# EAGLE design New_rev2 (EAGLE 6.1)
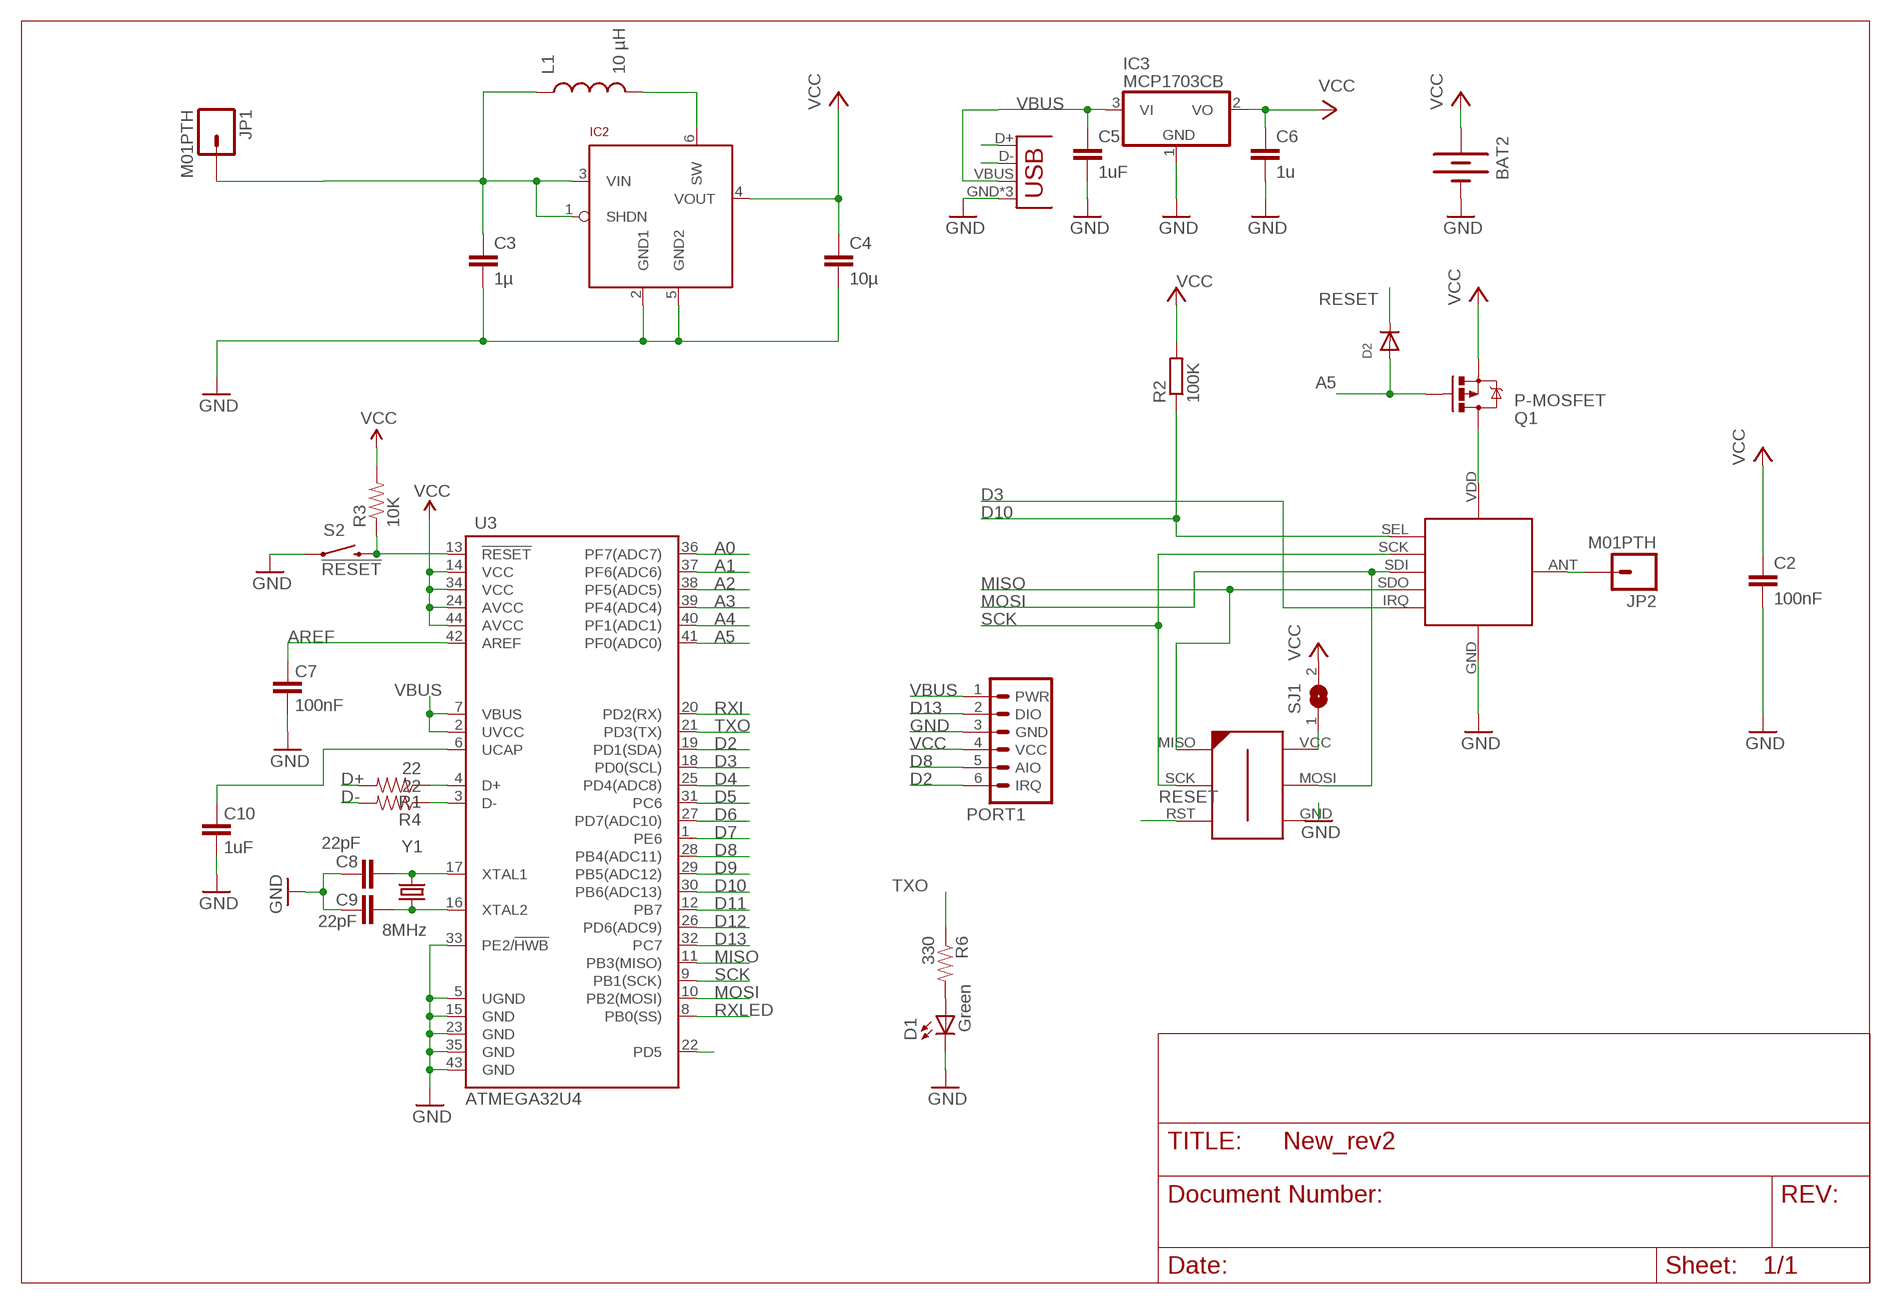
[diagram p0: schematic, sheet 1]

## Parts
BAT2  BATTERY20PTH  [BATTCOM_20MM_PTH]
C2  100nF  C-EUC0603K  [C0603K]
C3  1µ  CAP0603-CAP  [0603-CAP]
C4  10µ  CAP0805  [0805]
C5  1uF  C-EUC0603K  [C0603K]
C6  1u  C-EUC0603K  [C0603K]
C7  100nF  CAP0402-CAP  [0402-CAP]
C8  22pF  CAP0402-CAP  [0402-CAP]
C9  22pF  CAP0402-CAP  [0402-CAP]
C10  1uF  CAP0402-CAP  [0402-CAP]
D1  Green  LED0603  [LED-0603]
D2  DIODESOD-323F  [SOD-323F]
IC2  LTC3525  [SC70]
IC3  MCP1703CB  [SOT23]
JP1  M01PTH  [1X01]
JP2  M01PTH  [1X01]
JP3  USB-MICROB  [USB-MICROB]
L1  10 µH  INDUCTOR1210  [1210]
PORT1  JEEPORT-FEMALE  [1X06_FEMALE_LOCK.010]
Q1  P-MOSFET  MOSFET-PCHANNEL  [SOT23]
R1  22  RESISTOR0402-RES  [0402-RES]
R2  100K  R-EU_R0402  [R0402]
R3  10K  RESISTOR0402-RES  [0402-RES]
R4  22  RESISTOR0402-RES  [0402-RES]
R6  330  RESISTOR0402-RES  [0402-RES]
RFM12B1  RFM12B_MINPADS  [RFM12B-MINPADS]
S2  !RESET  SWITCH-MOMENTARY-2SMD  [TACTILE_SWITCH_SMD]
SJ1  SJ  [SJ]
U3  ATMEGA32U4  ATMEGA32U4QFN2  [QFN-44-NOPAD]
U$2  AVR-ISP-6-EDGE  [6PAD_ISP]
Y1  8MHz  CRYSTAL5X3  [CRYSTAL-SMD-5X3]

## Nets
A0: U3.36(PF7(ADC7))
A1: U3.37(PF6(ADC6))
A2: U3.38(PF5(ADC5))
A3: U3.39(PF4(ADC4))
A4: U3.40(PF1(ADC1))
A5: D2.A Q1.1(G) U3.41(PF0(ADC0))
AREF: C7.2 U3.42(AREF)
D2: PORT1.6(IRQ) U3.19(PD1(SDA))
D3: RFM12B1.IRQ U3.18(PD0(SCL))
D4: U3.25(PD4(ADC8))
D5: U3.31(PC6)
D6: U3.27(PD7(ADC10))
D7: U3.1(PE6)
D8: PORT1.5(AIO) U3.28(PB4(ADC11))
D9: U3.29(PB5(ADC12))
D10: R2.1 RFM12B1.SEL U3.30(PB6(ADC13))
D11: U3.12(PB7)
D12: U3.26(PD6(ADC9))
D13: PORT1.2(DIO) U3.32(PC7)
D+: JP3.D+ R1.2
D-: JP3.D- R4.2
GND: BAT2.2(-) C2.2 C3.2 C4.2 C5.2 C6.2 C7.1 C8.2 C9.2 C10.1 D1.C IC2.2(GND1) IC2.5(GND2) IC3.1(GND) JP3.GND JP3.MT1(GND) JP3.MT2(GND) PORT1.3(GND) RFM12B1.GND S2.1 U3.5(UGND) U3.15(GND) U3.23(GND) U3.33(PE2/!HWB) U3.35(GND) U3.43(GND) U$2.GND
MISO: RFM12B1.SDO(SDO/MISO) U3.11(PB3(MISO)) U$2.MISO
MOSI: RFM12B1.SDI(SDI/MOSI) U3.10(PB2(MOSI)) U$2.MOSI
N$1: C9.1 U3.16(XTAL2) Y1.1
N$2: R1.1 U3.4(D+)
N$3: JP2.1 RFM12B1.ANT
N$4: C8.1 U3.17(XTAL1) Y1.3
N$5: C10.2 U3.6(UCAP)
N$6: D1.A R6.2
N$7: R4.1 U3.3(D-)
N$8: U3.22(PD5)
N$9: SJ1.1 U$2.VCC
N$10: Q1.3(D) RFM12B1.VDD
N$13 [vcc]: IC2.6(SW) L1.2
RESET: D2.C R3.1 S2.3 U3.13(!RESET) U$2.RST
RXI: U3.20(PD2(RX))
RXLED: U3.8(PB0(SS))
SCK: RFM12B1.SCK U3.9(PB1(SCK)) U$2.SCK
TXO: R6.1 U3.21(PD3(TX))
VBUS: C5.1 IC3.3(VI) JP3.VBUS PORT1.1(PWR) U3.2(UVCC) U3.7(VBUS)
VCC: BAT2.1(+) C2.1 C4.1 C6.1 IC2.4(VOUT) IC3.2(VO) PORT1.4(VCC) Q1.2(S) R2.2 R3.2 SJ1.2 U3.14(VCC) U3.24(AVCC) U3.34(VCC) U3.44(AVCC)
VIN: C3.1 IC2.1(SHDN) IC2.3(VIN) JP1.1 L1.1

## Library data of the parts
BAT2 = SparkFun:BATTERY: Battery Holders Various common sizes : AA, AAA, 20mm coin cell and 12mm coin cell.
C2 C5 C6 = rcl:C-EU: CAPACITOR, European symbol
C3 C4 C7-C10 = SparkFun:CAP: Capacitor Standard 0603 ceramic capacitor, and 0.1" leaded capacitor.
D1 = SparkFun:LED: LEDs Standard schematic elements and footprints for 5mm, 3mm, 1206, and 0603 sized LEDs. 5mm - Spark Fun Electronics SKU : COM-00529 (and others)
D2 = adafruit:DIODE: Diode SMADIODE - SMA Surface Mount Package 20V 1A Schottky Diode Digikey: 641-1014-6-ND DO-1N4148 - Through Hole Small Current Diode SOD-123 20V 1 A (.5mV Vf) Schottky Diode - Digikey: MBRX120TPMSCT-ND SOD-323 10V 570mA (.38mV Vf, 3ns) Schottky Diode - Digikey: ZLLS410CT-ND SOD-523 30V 30mA Schottky Diode (RB751S-40TE61) - Digikey: RB751S-40TE61CT-ND SOT23-R/W - SOT23 Package (R = Solder Paste/Reflow Ovens, W = Hand-Soldering) BAT54Film 40V 300mA - Digikey: 497-7162-1-ND
IC2 = JeeLabs:LTC3525
IC3 = linear:MCP1703: 250 mA, 16V, Low Quiescent Current LDO Regulator Source: http://ww1.microchip.com/downloads/en/DeviceDoc/22049b.pdf
JP1 JP2 = SparkFun:M01: Header 1 Standard 1-pin 0.1" header. Use with straight break away headers (SKU : PRT-00116), right angle break away headers (PRT-00553), swiss pins (PRT-00743), machine pins (PRT-00117), and female headers (PRT-00115).
JP3 = SparkFun-Connectors:USB: USB Connectors USB-B-PTH is fully proven SKU : PRT-00139/CONN-08278 USB-miniB is fully proven SKU : PRT-00587 USB-A-PCB is untested. USB-A-H is throughly reviewed, but untested. Spark Fun Electronics SKU : PRT-00437 USB-B-SMT is throughly reviewed, but untested. Needs silkscreen touching up. USB-A-S has not been used/tested USB-MB-H has not been used/tested USB-MICROB has been used. CONN-09505; PROD_ID: CONN-09505
L1 = SparkFun:INDUCTOR: Inductors Basic Inductor/Choke - 0603 and 1206. Footprints are not proven and vary greatly between part numbers.
PORT1 = JeeParts:JEEPORT: PIN HEADER
Q1 = SparkFun:MOSFET-PCHANNEL
R1 R3 R4 R6 = SparkFun:RESISTOR: Resistor Basic schematic elements and footprints for 0603, 1206, and PTH resistors.
R2 = resistor:R-EU_: RESISTOR, European symbol
RFM12B1 = LowPowerLab:RFM12B_MINPADS
S2 = SparkFun-Electromechanical:SWITCH-MOMENTARY-2: Various NO switches- pushbuttons, reed, etc; PROD_ID: SWCH-08247
SJ1 = jumper:SJ: SMD solder JUMPER
U3 = SparkFun:ATMEGA32U4
U$2 = avr-7:AVR-ISP-6-EDGE: 6 pin edge connector for ISP with ATMEL MCUs. Developed by Craig Moates (craig at moates dot net). Library by David Blundell (blundar at gmail dot com). Often, even a 6 pin header is really inconvenient for board layout and/or production. This SMD-only header is our de-facto standard for using an edge connector for programming with the help of a 6pin/10pin to edge card adapter.
Y1 = SparkFun:CRYSTAL: Crystals Various standard crystals. Proven footprints. Spark Fun Electronics SKU : COM-00534

## Board
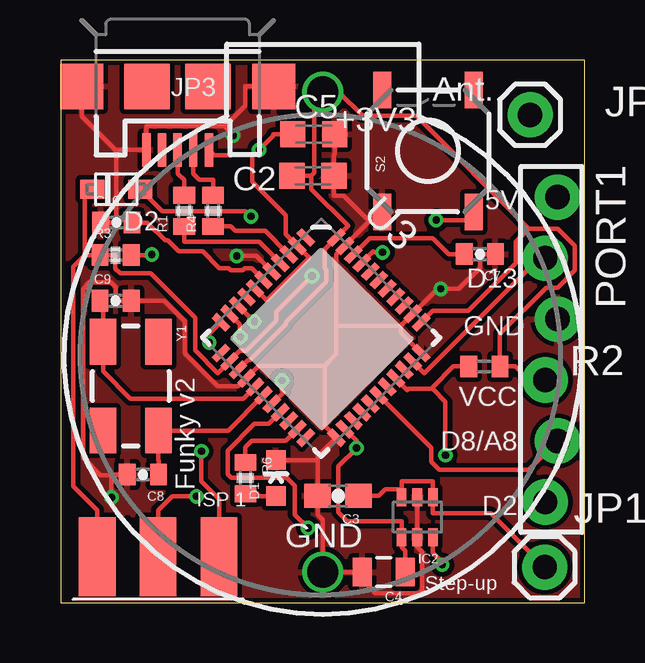
[diagram p1: board, top side]
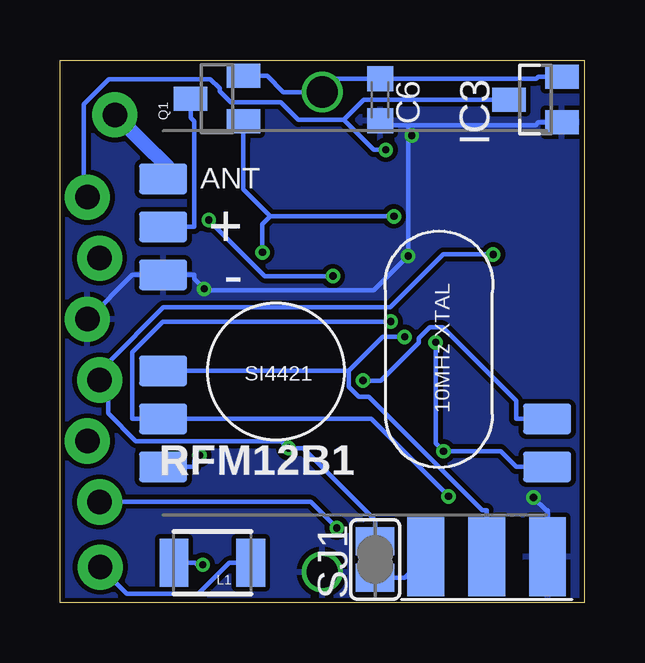
[diagram p2: board, bottom side, seen from below]

Size 21.84 x 22.61 mm. Coordinates in mm from the lower left corner, seen from the top.
Outline: 0,0 21.84,0 21.84,22.61 0,22.61 0,0
Copper layers (1*16): Top 0.035mm / dielectric 1.5mm / Bottom 0.035mm
Design rules: minimum track width 0.2mm, minimum drill 0.3mm, track to track 0.2mm, track to pad 0.2mm, pad to pad 0.2mm, via to via 0.2mm, smd to smd 0.2mm, copper to edge 0.2mm, drill to drill 0.2mm, minimum pad ring 0.2mm, minimum via ring 0.15mm, stop-mask expansion 0.075mm, vias tented up to drill 0.3mm, thermal gap 0.2mm
tRestrict: 2 lines
bRestrict: 2 lines

### Footprints (pad centres in the part's own frame; a part is rotated, then mirrored left to right if it is on the bottom)
BATTCOM_20MM_PTH = drill 1.3: 1 20,0; 2 0,0
C0603K = smd 1.05 x 1.08: 1 -0.875,0; 2 0.875,0
0603-CAP = smd 1.1 x 1: 1 -0.85,0; 2 0.85,0
0805 = smd 0.8 x 1.2: 1 -0.9,0; 2 0.9,0
0402-CAP = smd 0.7 x 0.9: 1 -0.65,0; 2 0.65,0
LED-0603 = smd 0.8 x 0.8: A 0,-0.75; C 0,0.75
SOD-323F = smd 1 x 0.8: A -1,0; C 1,0
SC70 = smd 0.4 x 0.75: 1 -0.65,-0.825; 2 0,-0.825; 3 0.65,-0.825; 4 0.65,0.825; 5 0,0.825; 6 -0.65,0.825
SOT23 = smd 1 x 1.4: 1 -0.95,-1.1; 2 0.95,-1.1; 3 0,1.1
1X01 = drill 1.016 pad 1.88: 1 0,0
USB-MICROB = smd 0.35 x 1.4: D+ 0,2.65; D- -0.65,2.65; GND 1.3,2.65; ID 0.65,2.65; VBUS -1.3,2.65 | smd 1.8 x 1.9: MT1 -4,0; MT2 4,0 | smd 1.9 x 1.9: P$1 -1.27,0; P$2 1.27,0
1210 = smd 1.2 x 2: 1 -1.6,0; 2 1.6,0
1X06_FEMALE_LOCK.010 = drill 1.016 pad 1.88: 1 0,0.254; 2 2.54,-0.254; 3 5.08,0.254; 4 7.62,-0.254; 5 10.16,0.254; 6 12.7,-0.254
0402-RES = smd 0.7 x 0.9: 1 -0.65,0; 2 0.65,0
R0402 = smd 0.7 x 0.9: 1 -0.65,0; 2 0.65,0
RFM12B-MINPADS = smd 2 x 1.27: ANT 8,-6; GND 8,-2; IRQ -8,4; SCK 8,4; SDI 8,2; SDO -8,6; SEL 8,6; VDD 8,-4
TACTILE_SWITCH_SMD = smd 1.524 x 0.762: 1 -2.54,1.905; 2 2.54,1.905; 3 -2.54,-1.905; 4 2.54,-1.905
SJ = smd 1.168 x 1.6: 1 -0.762,0; 2 0.762,0
QFN-44-NOPAD = smd 0.8 x 0.3: 1 -3.4,2.5; 2 -3.4,2; 3 -3.4,1.5; 4 -3.4,1; 5 -3.4,0.5; 6 -3.4,0; 7 -3.4,-0.5; 8 -3.4,-1; 9 -3.4,-1.5; 10 -3.4,-2; 11 -3.4,-2.5; 23 3.4,-2.5; 24 3.4,-2; 25 3.4,-1.5; 26 3.4,-1; 27 3.4,-0.5; 28 3.4,0; 29 3.4,0.5; 30 3.4,1; 31 3.4,1.5; 32 3.4,2; 33 3.4,2.5 | smd 0.3 x 0.8: 12 -2.5,-3.4; 13 -2,-3.4; 14 -1.5,-3.4; 15 -1,-3.4; 16 -0.5,-3.4; 17 0,-3.4; 18 0.5,-3.4; 19 1,-3.4; 20 1.5,-3.4; 21 2,-3.4; 22 2.5,-3.4; 34 2.5,3.4; 35 2,3.4; 36 1.5,3.4; 37 1,3.4; 38 0.5,3.4; 39 0,3.4; 40 -0.5,3.4; 41 -1,3.4; 42 -1.5,3.4; 43 -2,3.4; 44 -2.5,3.4
6PAD_ISP = smd 1.524 x 3.302 bottom: GND 2.54,0; MOSI 0,0; VCC -2.54,0 | smd 1.524 x 3.302: MISO -2.54,0; RST 2.54,0; SCK 0,0
CRYSTAL-SMD-5X3 = smd 1.9 x 1.1: 1 -1.85,-1.15; 2 1.85,-1.15; 3 1.85,1.15; 4 -1.85,1.15

### Placement (x,y rotation side)
BAT2  10.92,1.27 90 top
C2  10.51,17.78 0 top
C3  11.56,4.45 180 top
C4  13.46,1.27 180 top
C5  10.54,19.51 0 top
C6  8.51,20.96 270 bottom
C7  17.47,14.52 180 top
C8  3.43,5.33 180 top
C9  2.29,12.57 0 top
C10  2.32,15.84 0 top
D1  8.97,5.19 0 top
D2  2.31,17.22 180 top
IC2  14.86,3.56 180 top
IC3  2.03,20.96 90 bottom
JP1  20.17,1.48 0 top
JP2  19.56,20.32 0 top
JP3  4.87,21.51 180 top
L1  15.49,1.65 180 bottom
PORT1  20.45,16.89 270 top
Q1  15.3,21 90 bottom
R1  5.15,16.32 90 top
R2  17.65,9.84 0 top
R3  2.29,14.48 0 top
R4  6.35,16.32 90 top
R6  7.7,5.18 270 top
RFM12B1  9.54,11.65 180 bottom
S2  15.3,18.82 90 top
SJ1  8.71,1.8 90 bottom
U3  10.85,11.04 315 top
U$2  4.06,1.9 180 top
Y1  2.92,9.02 270 top

### Tracks (layer width: path | path; a pad name or v marks a point on that pad's centre or on a via)
A5  (via drill 0.3 pad 0.6)
  Top 0.18: D2.A 4.22,16.31 7.71,16.31 v7.93,16.09 | v13.41,14.59 13.08,14.59 13.03,14.64 12.59,14.19 U3.41
  Top 0.2: U3.41 12.58,14.19 12.59,14.19
  Bottom 0.18: 13.08,16.09 v7.93,16.09 | Q1.1 14.2,19.26 14.2,17.22 13.08,16.09 | 13.08,16.09 13.41,15.76 v13.41,14.59
AREF
  Top 0.18: U3.42 12.28,14.59 12.68,14.99 12.87,15.18 15.51,15.18 16.17,14.52 C7.2
  Top 0.2: U3.42 12.28,14.59
D2  (via drill 0.3 pad 0.6)
  Top 0.18: v10.31,3.11 9.75,3.67 9.75,4.87 9.42,5.2 7.1,5.2 6.96,5.34 6.96,6.33 8.07,7.44 8.66,7.44 | 8.66,7.44 | U3.19 8.66,7.44
  Top 0.2: 9.18,7.99 U3.19 9.18,7.99
  Bottom 0.18: v10.31,3.11 11.4,4.19 PORT1.6
D3  (via drill 0.3 pad 0.6)
  Top 0.18: U3.18 9.29,8.77 9.22,8.84 v9.22,9.25
  Top 0.2: U3.18
  Bottom 0.18: v9.22,9.25 8.47,9.25 6.89,10.83 6.89,11.01 6.44,11.46 5.9,11.46 2.83,8.4 2.83,7.65 RFM12B1.IRQ
D8
  Top 0.18: U3.28 15.44,6.45 15.44,5.86 15.77,5.53 19.5,5.53 PORT1.5
  Top 0.2: 13.18,8.69 U3.28 13.18,8.69
D10  (via drill 0.3 pad 0.6)
  Top 0.18: 15.5,8.9 16.03,8.36 v16.03,6.14 | 15.5,8.9 15.5,8.98 16.36,9.84 R2.1 | 15.5,8.9 14.49,8.9 14.45,8.86 U3.30
  Top 0.2: 13.88,9.39 U3.30 13.88,9.39
  Bottom 0.18: v16.03,6.14 16.25,5.92 16.25,5.65 RFM12B1.SEL
D13
  Top 0.18: U3.32 15.16,9.56 19.94,14.35 PORT1.2
  Top 0.2: 14.68,10.09 U3.32 14.68,10.09
D+
  Top 0.18: JP3.D+ 4.87,17.87 4.89,17.87 5.15,17.61 R1.2
D-
  Top 0.18: JP3.D- 5.52,17.87 5.78,17.61 6.35,17.61 R4.2
GND  (via drill 0.3 pad 0.6)
  Top 0.18: 14.18,11.54 14.18,11.25 14.53,10.89 U3.33 | 14.18,11.54 14.25,11.61 U3.35 15.71,13.07 v15.84,13.07 16.59,13.07 17.48,13.96 17.48,14.52 C7.1 | 14.18,11.54 | 14.18,11.54 11.49,11.54 | 11.49,11.54 11.49,10.36 11,9.86 | 11.49,11.54 11.49,14.51 U3.43 12.86,15.88 | 11,9.86 8.26,9.86 U3.15 7.4,9.01 6.55,9.01 5.16,10.39 5.16,11.72 4.31,12.57 3.58,12.57 C9.2 2.3,12.57 2.3,13.13 2.09,13.34 1.18,13.34 0.93,13.08 0.93,6.04 1.66,5.31 2.11,5.31 | 11,9.86 11,7.36 U3.23 10.71,6.09 10.71,5.94 | C8.2 2.14,5.33 2.11,5.31 | 2.11,5.31 v2.11,4.37 | C5.2 11.42,18.68 11.39,18.64 C2.2 11.39,16.95 11.79,16.95 12.86,15.88 | S2.1 13.26,16.28 12.86,15.88 | 12.22,1.27 13.11,0.38 14.95,0.38 15.07,0.5 15.07,2.11 14.86,2.32 IC2.5 IC2.2 | 12.22,1.27 11.87,1.27 BAT2.2 10.92,3.44 10.71,3.66 C3.2 10.71,5.94 | C4.2 12.22,1.27 | 6.84,19.85 7.19,19.5 v7.19,19.46 | 6.84,19.85 7.68,20.69 7.68,21.51 JP3.MT1 | 6.84,19.85 3.57,19.85 JP3.GND 2.31,18.86 | 2.31,18.86 2.28,18.86 0.87,20.27 JP3.MT2 | 2.31,18.86 2.31,15.84 C10.1 | v7.34,14.44 8.15,14.44 U3.5 | 10.71,5.94 D1.C
  Bottom 0.18: U$2.GND 1.52,3.85 1.59,3.85 v2.11,4.37 | 7.34,19.46 v7.19,19.46 | 7.34,19.46 v7.34,14.44 8.76,13.02 15.78,13.02 v15.84,13.07 16.25,13.49 16.25,13.65 RFM12B1.GND 18.19,13.65 18.83,13.65 20.67,11.81 PORT1.3 | 7.34,19.9 7.34,19.46 | 7.34,19.9 8.51,19.9 C6.2 | 7.34,19.9 2.03,19.9 1.92,20.01 IC3.1
  pour Top: -0.38,22.99 21.84,22.99 21.84,-0.51 -0.38,-0.51
  pour Bottom: -0.38,22.99 21.84,22.99 21.84,0.13 -0.38,0.13
MISO  (via drill 0.3 pad 0.6)
  Top 0.18: U3.11 6.19,11.19 v6.19,10.84 | v5.87,6.3 5.87,5.05 6.6,4.31 6.6,3.85 U$2.MISO
  Top 0.2: 6.68,11.69 U3.11 6.68,11.69
  Bottom 0.18: v6.19,10.84 6.19,6.63 v5.87,6.3 3.49,6.3 2.83,5.65 RFM12B1.SDO
MOSI  (via drill 0.3 pad 0.6)
  Top 0.18: U3.10 7.47,11.59 7.47,11.09 v7.48,11.07
  Top 0.2: 6.98,12.09 U3.10 6.98,12.09
  Bottom 0.18: v7.48,11.07 8.39,11.07 9.81,9.65 | 9.81,9.65 9.81,9 9.39,8.58 8.97,8.58 4.24,3.85 4.06,3.85 U$2.MOSI | 9.81,9.65 16.25,9.65 RFM12B1.SDI
N$1
  Top 0.18: U3.16 | U3.16 7.6,8.5 2.9,8.5 1.77,9.63 Y1.1 1.77,11.45 1.77,12.11 1.64,12.24 C9.1
  Top 0.2: U3.16
N$2
  Top 0.18: U3.4 9.1,14.21 8.27,15.03 7.09,15.03 5.15,15.03 R1.1
  Top 0.2: U3.4 9.08,14.19 9.1,14.21
N$3
  Bottom 0.18: RFM12B1.ANT 17.36,18.16 | 19.54,20.3 JP2.1
  Bottom 0.61: 17.36,18.16 19.54,20.3
N$4
  Top 0.18: U3.17 6.98,7.17 Y1.3 4.07,5.93 4.08,5.92 C8.1
  Top 0.2: 8.48,8.69 U3.17 8.48,8.69
N$5
  Top 0.18: 7.96,13.93 | 7.96,13.93 7.66,13.93 7.58,13.85 7.09,13.85 7.01,13.93 6.61,13.93 5.91,14.63 4.93,14.63 4.46,15.09 4.35,15.09 3.61,15.84 C10.2 | U3.6 8.39,13.5 7.96,13.93
  Top 0.2: U3.6 8.38,13.49 8.39,13.5
N$6
  Top 0.18: D1.A 8.28,4.44 8.18,4.54 R6.2
N$7
  Top 0.18: U3.3 9.45,14.56 8.53,15.48 7.28,15.48 7.09,15.67 R4.1
  Top 0.2: U3.3 9.48,14.59 9.45,14.56
N$9
  Bottom 0.18: U$2.VCC 7.47,1.03 SJ1.1
N$10
  Bottom 0.18: Q1.3 16.4,20.21 16.25,20.06 16.25,15.65 RFM12B1.VDD
N$13  (via drill 0.3 pad 0.6)
  Top 0.18: IC2.6 15.51,2.07 15.9,1.68 v15.9,1.58
  Bottom 0.18: L1.2 16.2,1.65 16.13,1.58 v15.9,1.58
RESET  (via drill 0.3 pad 0.6)
  Top 0.18: v10.47,13.61 8.99,12.13 8.99,11.75 7.73,10.48 7.46,10.48 U3.13 6.54,9.56 5.6,10.5 5.6,11.87 3.75,13.72 2.48,13.72 2.28,13.92 2.28,14.48 R3.1 1,14.48 | S2.3 16.87,15.94 v15.65,15.94 | U$2.RST 1.52,3.85 0.52,4.85 0.52,14 1,14.48 | D2.C 1,16.9 1,14.48
  Top 0.2: 7.08,10.09 U3.13 7.08,10.09
  Bottom 0.18: v15.65,15.94 13.31,13.61 v10.47,13.61
SCK  (via drill 0.3 pad 0.6)
  Top 0.18: U3.9 v8.06,11.71 | U$2.SCK 4.06,3.85 4.64,4.42 v5.66,4.42
  Top 0.2: U3.9
  Bottom 0.18: v8.06,11.71 17.56,11.71 18.83,10.43 18.83,7.65 RFM12B1.SCK 8.88,7.65 v5.66,4.42
TXO
  Top 0.18: R6.1 7.7,6.47 7.96,6.73 9.37,6.73 U3.21
  Top 0.2: 9.88,7.29 U3.21 9.88,7.29
VBUS  (via drill 0.3 pad 0.6)
  Top 0.18: U3.7 8.58,12.6 10.04,14.06 | 10.04,14.06 | 10.04,14.06 10.35,14.37 9.9,14.81 U3.2 9.37,15.35 9.37,16.14 7.98,17.53 7.98,18.64 | C5.1 8.85,19.51 8.85,19.45 v8.27,18.86 8.21,18.86 7.98,18.64 | JP3.VBUS 6.39,18.64 7.98,18.64
  Top 0.2: 9.9,14.81 9.88,14.79 U3.2 | U3.7
  Bottom 0.18: 10.03,20.11 8.78,18.86 v8.27,18.86 | 10.03,20.11 11.92,20.11 12.64,20.84 14.72,20.84 15.19,21.31 15.19,21.43 15.58,21.81 19.81,21.81 20.85,20.77 20.85,17.04 PORT1.1 | IC3.3 9.18,20.96 10.03,20.11
VCC  (via drill 0.3 pad 0.6)
  Top 0.18: 11,14.72 | 11,14.72 11,13.92 11.06,13.86 11.06,13.85 11.06,13.36 9.37,11.67 9.37,11.59 7.89,10.1 7.79,10.1 U3.14 | U3.24 11.88,7.18 12.33,6.73 v12.33,6.44 11.57,5.67 11.57,3.77 11.94,3.4 14.21,3.4 IC2.4 14.21,2.31 14.36,2.16 C4.1 | v3.79,14.5 3.6,14.5 3.58,14.48 R3.2 | 11,14.72 U3.44 11.57,15.3 11.97,15.7 10.45,17.22 10.45,17.78 | 10.45,17.78 10.57,17.9 10.57,20.92 BAT2.1 11.59,21.27 12.58,20.28 14.81,20.28 19.51,15.58 | 19.51,15.58 18.96,15.03 18.96,14.14 16.98,12.16 15.51,12.16 15.06,11.72 U3.34 | 19.51,15.58 20.7,15.58 21.42,14.86 21.42,13.84 20.7,13.12 20.23,13.12 18.3,11.2 18.3,10.58 R2.2 18.94,9.84 19.51,9.27 PORT1.4 | C2.1 10.45,17.78
  Top 0.2: 11.88,7.18 11.88,7.19 U3.24 | U3.44 11.58,15.29 11.57,15.3 | U3.34 15.08,11.69 15.06,11.72 | U3.14
  Bottom 0.18: 19.83,9.27 19.83,7.88 18.68,6.73 12.62,6.73 v12.33,6.44 11.71,6.44 8.71,3.43 SJ1.2 | 19.83,9.27 19.83,10 17.54,12.3 8.07,12.3 5.87,14.5 v3.79,14.5 | PORT1.4 19.83,9.27 | IC3.2 1.92,21.91 2,21.83 C6.1 10.36,21.83 BAT2.1 12.54,21.27 13.21,21.95 Q1.2
VIN
  Top 0.18: JP1.1 17.93,3.72 15.51,3.72 IC2.1 15.51,5.05 14.21,5.05 14.21,4.71 | C3.1 13.25,4.45 13.52,4.71 14.21,4.71 | IC2.3 14.21,4.71
  Bottom 0.18: L1.1 14.78,1.65 16.07,0.36 19.05,0.36 JP1.1

### Text on the board
tPlace: Ant. | +3V3 | 5V | D13 | GND | VCC | D8/A8 | Funky v2 | ISP 1 | GND | D2 | Step-up